# Altium schematic sheet 主控板-国赛.SchDoc: *主控板
size A3; Date: 1; Author: 1*; CompanyName: 1; Organization: 1; DocumentNumber: 1; Revision: 文小林; SheetNumber: 1; SheetTotal: 1; CurrentDate: 1; Time: 1; DocumentFullPathAndName: 1; DocumentName: 1; ProjectName: 1
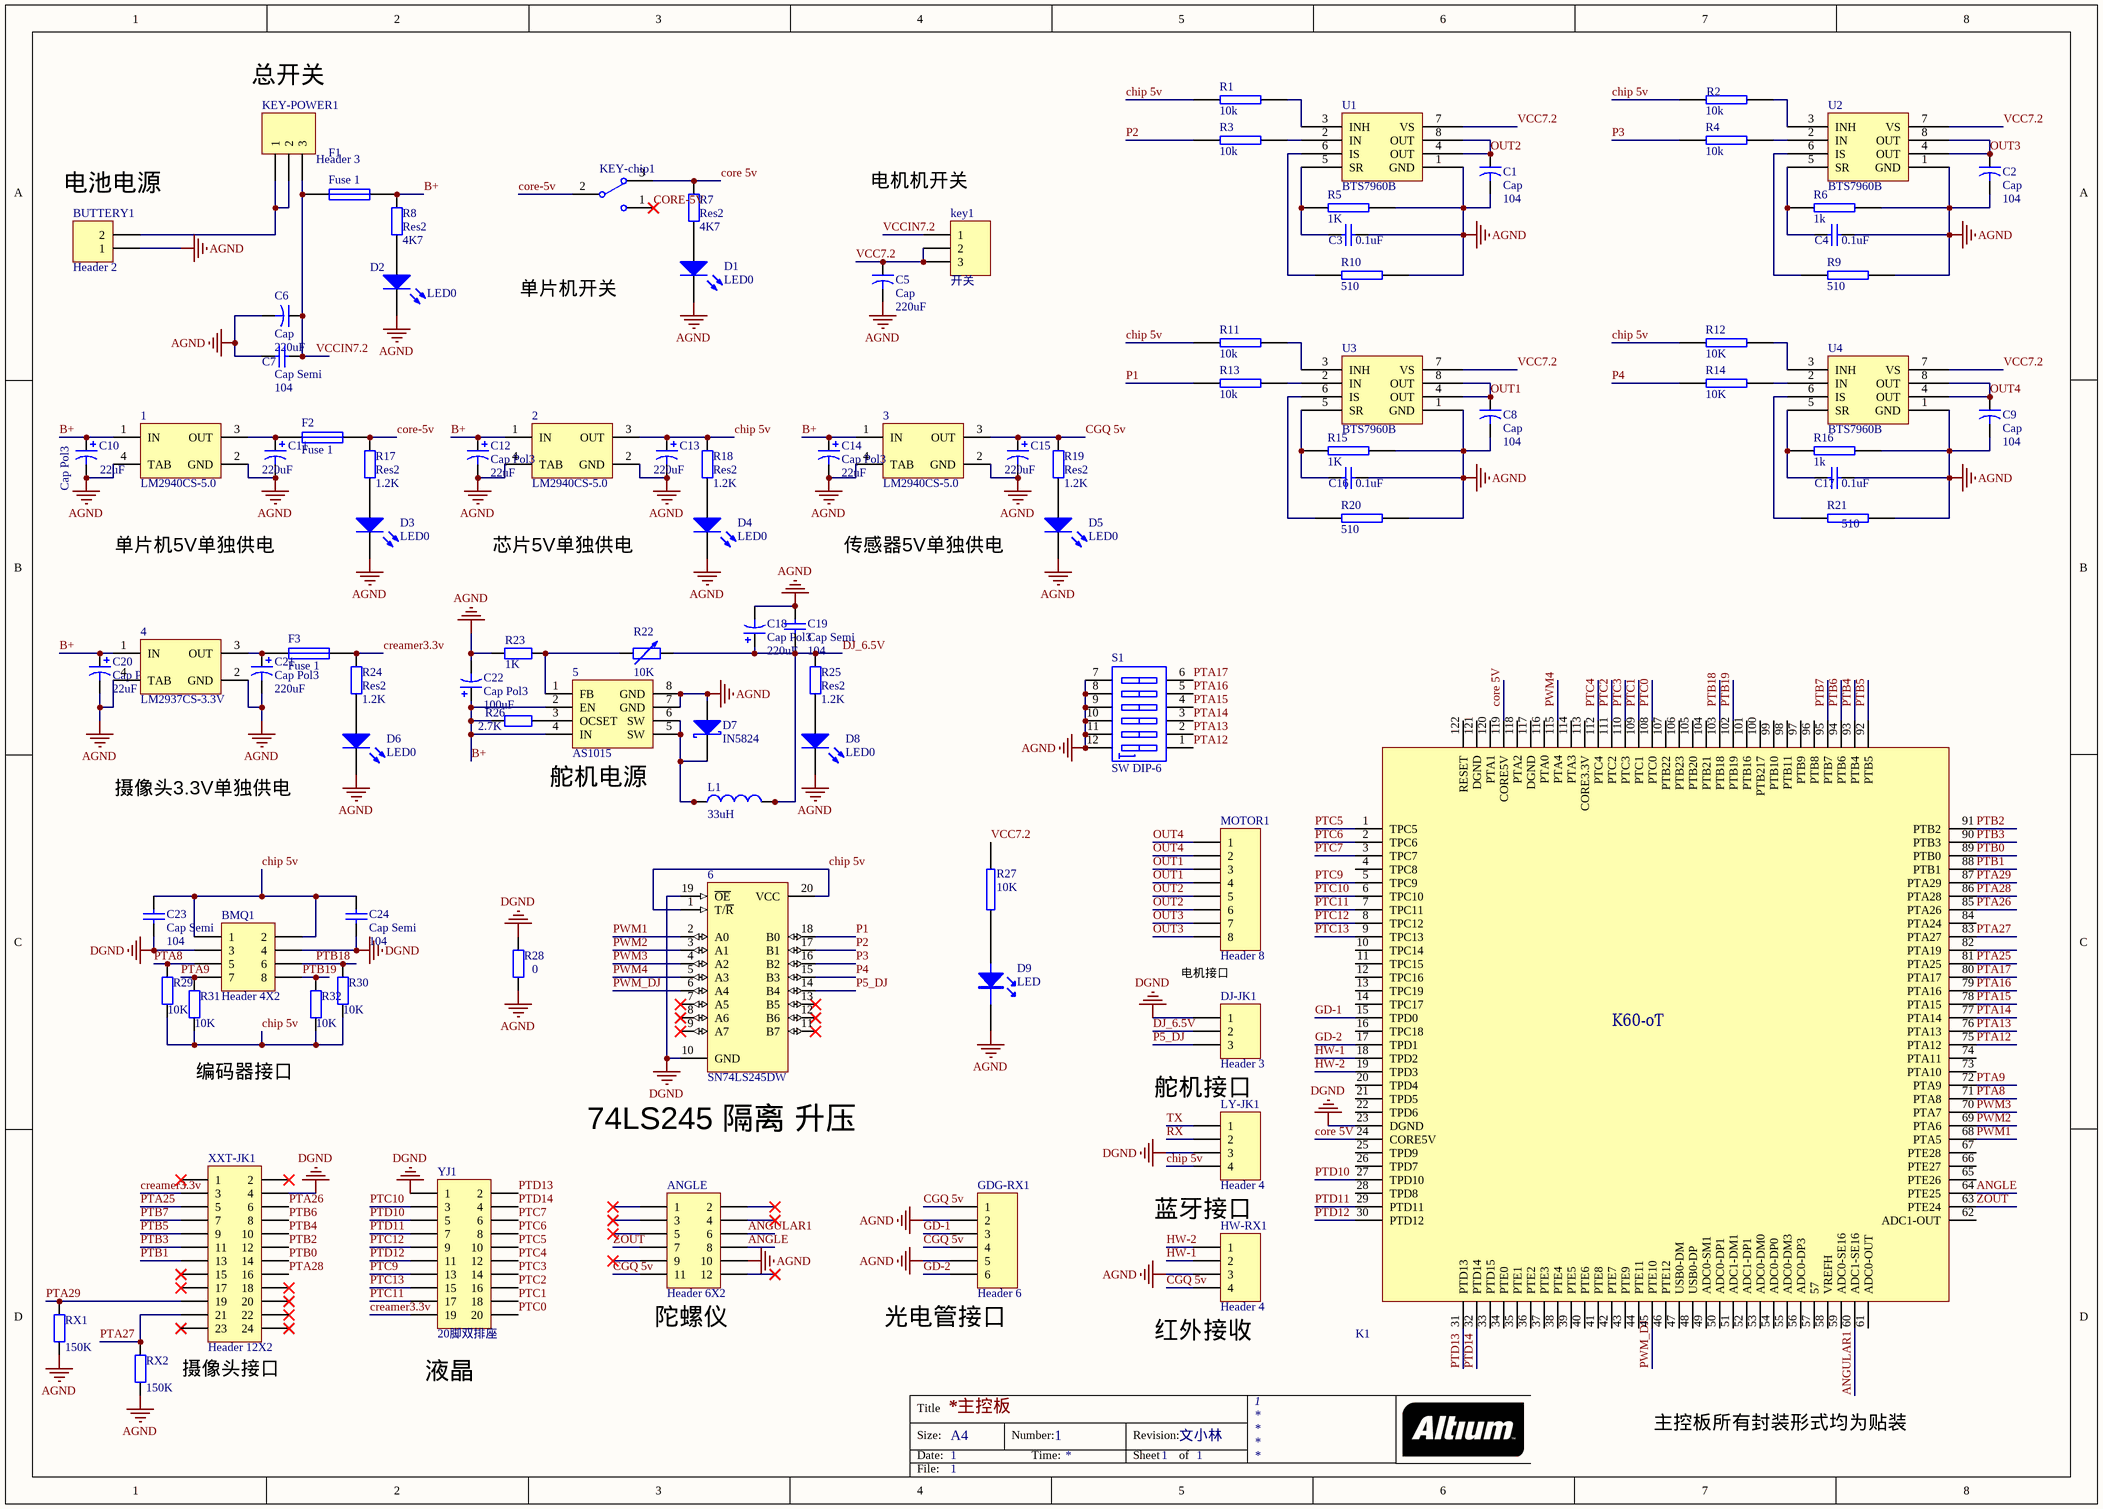
[diagram p0: 主控板-国赛.SchDoc]

## Parts
1  LM2940CS-5.0  [PCBComponent_1]
2  LM2940CS-5.0  [PCBComponent_1]
3  LM2940CS-5.0  [PCBComponent_1]
4  LM2937CS-3.3V  [PCBComponent_1]
5  AS1015  [SOIC-8(TPS7350)]
6  SN74LS245DW  [SN74HCxx-20P]
ANGLE  Header 6X2  [HDR2X6]
BMQ1  Header 4X2  [HDR2X4]
BUTTERY1  Header 2  [电源]
C1  Cap  value 104  [0805]
C2  Cap  value 104  [0805]
C3  value 0.1uF  [0805]
C4  value 0.1uF  [0805]
C5  Cap  value 220uF  [PCBComponent_1]
C6  Cap  value 220uF  [PCBComponent_1]
C7  Cap Semi  value 104  [0805]
C8  Cap  value 104  [0805]
C9  Cap  value 104  [0805]
C10  Cap Pol3  value 22uF  [PCBComponent_1]
C11  value 220uF  [PCBComponent_1]
C12  Cap Pol3  value 22uF  [PCBComponent_1]
C13  value 220uF  [PCBComponent_1]
C14  Cap Pol3  value 22uF  [PCBComponent_1]
C15  value 220uF  [PCBComponent_1]
C16  value 0.1uF  [0805]
C17  value 0.1uF  [0805]
C18  Cap Pol3  value 220uF  [PCBComponent_1]
C19  Cap Semi  value 104  [0805]
C20  Cap Pol3  value 22uF  [PCBComponent_1]
C21  Cap Pol3  value 220uF  [PCBComponent_1]
C22  Cap Pol3  value 100uF  [PCBComponent_1]
C23  Cap Semi  value 104  [0805]
C24  Cap Semi  value 104  [0805]
D1  LED0  [PCBComponent_1]
D2  LED0  [PCBComponent_1]
D3  LED0  [PCBComponent_1]
D4  LED0  [PCBComponent_1]
D5  LED0  [PCBComponent_1]
D6  LED0  [PCBComponent_1]
D7  IN5824  [PCBComponent_1]
D8  LED0  [PCBComponent_1]
D9  LED  [PCBComponent_1]
DJ-JK1  Header 3  [HDR1X3]
F1  Fuse 1  [PCBComponent_1]
F2  Fuse 1  [PCBComponent_1]
F3  Fuse 1  [PCBComponent_1]
GDG-RX1  Header 6  [HDR1X6]
HW-RX1  Header 4  [HDR1X4]
K1  K60-4  [PCBComponent_1]  (value not drawn)
key1  开关  [扭子开关（3脚）]
KEY-chip1  SW-SPDT  [HDR1X3]  (value not drawn)
KEY-POWER1  Header 3  [扭子开关（3脚）]
L1  value 33uH  [PCBComponent_1]  (hidden comment: 33uH(工字电感))
LY-JK1  Header 4  [PCBComponent_1]
MOTOR1  Header 8  [PCBComponent_1]
R1  10k  [0805]
R2  10k  [0805]
R3  10k  [0805]
R4  10k  [0805]
R5  1K  [0805]
R6  1k  [0805]
R7  Res2  value 4K7  [0805]
R8  Res2  value 4K7  [0805]
R9  510  [0805]
R10  510  [0805]
R11  10k  [0805]
R12  10K  [0805]
R13  10k  [0805]
R14  10K  [0805]
R15  1K  [0805]
R16  1k  [0805]
R17  Res2  value 1.2K  [0805]
R18  Res2  value 1.2K  [0805]
R19  Res2  value 1.2K  [0805]
R20  510  [0805]
R21  510  [0805]
R22  value 10K  [卧式可变电阻器]  (hidden comment: Res Adj2)
R23  value 1K  [0805]  (hidden comment: Res2)
R24  Res2  value 1.2K  [0805]
R25  Res2  value 1.2K  [0805]
R26  value 2.7K  [0805]  (hidden comment: Res2)
R27  10K  [0805]
R28  value 0  [0805]
R29  value 10K  [0805]
R30  value 10K  [0805]
R31  value 10K  [0805]
R32  value 10K  [0805]
RX1  value 150K  [0805]
RX2  value 150K  [0805]
S1  SW DIP-6  [DIP-12/SW]
U1  BTS7960B  [PCBComponent_1]
U2  BTS7960B  [PCBComponent_1]
U3  BTS7960B  [PCBComponent_1]
U4  BTS7960B  [PCBComponent_1]
XXT-JK1  Header 12X2  [PCBComponent_1]
YJ1  20脚双排座  [HDR2X10]

## Nets
AGND: 1.2(GND) 1.4(TAB) 2.2(GND) 2.4(TAB) 3.2(GND) 3.4(TAB) 4.2(GND) 4.4(TAB) 5.7(GND) 5.8(GND) ANGLE.10 BUTTERY1.1 C1.2 C2.2 C3.1 C4.1 C5.2 C6.2 C7.1 C8.2 C9.2 C10.2 C11.2 C12.2 C13.2 C14.2 C15.2 C16.1 C17.1 C18.2 C19.2 C20.2 C21.2 C22.2 D1.2(K) D2.2(K) D3.2(K) D4.2(K) D5.2(K) D6.2(K) D7.1(A) D8.2(K) D9.2 GDG-RX1.2 GDG-RX1.5 HW-RX1.3 R5.2 R6.2 R9.2 R10.2 R15.2 R16.2 R20.2 R21.2 R23.1 R28.1 RX1.1 RX2.1 S1.7(B6) S1.8(B5) S1.9(B4) S1.10(B3) S1.11(B2) S1.12(B1) U1.1(GND) U2.1(GND) U3.1(GND) U4.1(GND)
DGND: 6.10(GND) 6.19(~{OE}) BMQ1.3 BMQ1.4 C23.1 C24.1 DJ-JK1.1 K1.23(DGND) LY-JK1.3 R28.2 XXT-JK1.4 YJ1.1
ANGLE: ANGLE.8 K1.64(PTE25)
ANGULAR1: ANGLE.6 K1.60(ADC1-SE16)
B+: 1.1(IN) 2.1(IN) 3.1(IN) 4.1(IN) 5.2(EN) 5.4(IN) C10.1 C12.1 C14.1 C20.1 C22.1 F1.2 R8.2 R26.2
CGQ 5v: 3.3(OUT) ANGLE.11 C15.1 GDG-RX1.1 GDG-RX1.4 HW-RX1.4 R19.2
chip 5v: 2.3(OUT) 6.1(T/~{R}) 6.20(VCC) BMQ1.1 BMQ1.2 C13.1 C23.2 C24.2 LY-JK1.4 R1.1 R2.1 R11.1 R12.1 R18.2 R29.1 R30.1 R31.1 R32.1
core 5v: K1.24(CORE5V) K1.119(CORE5V) KEY-chip1.3 R7.2
core-5v: F2.2 KEY-chip1.1 KEY-chip1.2 R17.2
creamer3.3v: F3.2 R24.2 XXT-JK1.3 YJ1.19
DJ_6.5V: C18.1 C19.1 DJ-JK1.2 L1.2 R22.2 R25.2
GD-1: GDG-RX1.3 K1.15(TPD0)
GD-2: GDG-RX1.6 K1.17(TPD1)
HW-1: HW-RX1.2 K1.18(TPD2)
HW-2: HW-RX1.1 K1.19(TPD3)
OUT1: C8.1 MOTOR1.3 MOTOR1.4 U3.4(OUT) U3.8(OUT)
OUT2: C1.1 MOTOR1.5 MOTOR1.6 U1.4(OUT) U1.8(OUT)
OUT3: C2.1 MOTOR1.7 MOTOR1.8 U2.4(OUT) U2.8(OUT)
OUT4: C9.1 MOTOR1.1 MOTOR1.2 U4.4(OUT) U4.8(OUT)
P1: 6.18(B0) R13.1
P2: 6.17(B1) R3.1
P3: 6.16(B2) R4.1
P4: 6.15(B3) R14.1
P5_DJ: 6.14(B4) DJ-JK1.3
PTA8: BMQ1.5 K1.71(PTA8) R29.2
PTA9: BMQ1.7 K1.72(PTA9) R31.2
PTA12: K1.75(PTA12) S1.1(A1)
PTA13: K1.76(PTA13) S1.2(A2)
PTA14: K1.77(PTA14) S1.3(A3)
PTA15: K1.78(PTA15) S1.4(A4)
PTA16: K1.79(PTA16) S1.5(A5)
PTA17: K1.80(PTA17) S1.6(A6)
PTA25: K1.81(PTA25) XXT-JK1.5
PTA26: K1.85(PTA26) XXT-JK1.6
PTA27: K1.83(PTA27) RX2.2 XXT-JK1.21
PTA28: K1.86(PTA28) XXT-JK1.16
PTA29: K1.87(PTA29) RX1.2 XXT-JK1.19
PTB0: K1.89(PTB0) XXT-JK1.14
PTB1: K1.88(PTB1) XXT-JK1.13
PTB2: K1.91(PTB2) XXT-JK1.12
PTB3: K1.90(PTB3) XXT-JK1.11
PTB4: K1.93(PTB4) XXT-JK1.10
PTB5: K1.92(PTB5) XXT-JK1.9
PTB6: K1.94(PTB6) XXT-JK1.8
PTB7: K1.95(PTB7) XXT-JK1.7
PTB18: BMQ1.6 K1.103(PTB18) R30.2
PTB19: BMQ1.8 K1.102(PTB19) R32.2
PTC0: K1.108(PTC0) YJ1.20
PTC1: K1.109(PTC1) YJ1.18
PTC2: K1.111(PTC2) YJ1.16
PTC3: K1.110(PTC3) YJ1.14
PTC4: K1.112(PTC4) YJ1.12
PTC5: K1.1(TPC5) YJ1.10
PTC6: K1.2(TPC6) YJ1.8
PTC7: K1.3(TPC7) YJ1.6
PTC9: K1.5(TPC9) YJ1.13
PTC10: K1.6(TPC10) YJ1.3
PTC11: K1.7(TPC11) YJ1.17
PTC12: K1.8(TPC12) YJ1.9
PTC13: K1.9(TPC13) YJ1.15
PTD10: K1.27(TPD10) YJ1.5
PTD11: K1.29(PTD11) YJ1.7
PTD12: K1.30(PTD12) YJ1.11
PTD13: K1.31(PTD13) YJ1.2
PTD14: K1.32(PTD14) YJ1.4
PWM1: 6.2(A0) K1.68(PTA5)
PWM2: 6.3(A1) K1.69(PTA6)
PWM3: 6.4(A2) K1.70(PTA7)
PWM4: 6.5(A3) K1.115(PTA4)
PWM_DJ: 6.6(A4) K1.45(PTE10)
RX: LY-JK1.2
TX: LY-JK1.1
VCC7.2: C5.1 key1.2 key1.3 R27.1 U1.7(VS) U2.7(VS) U3.7(VS) U4.7(VS)
VCCIN7.2: C6.1 C7.2 F1.1 key1.1 KEY-POWER1.3
ZOUT: ANGLE.7 K1.63(PTE24)
Net1_3: 1.3(OUT) C11.1 F2.1
Net4_3: 4.3(OUT) C21.1 F3.1
Net5_1: 5.1(FB) R22.1 R23.2
Net5_3: 5.3(OCSET) R26.1
Net5_5: 5.5(SW) 5.6(SW) D7.2(K) L1.1
NetBUTTERY1_2: BUTTERY1.2 KEY-POWER1.1 KEY-POWER1.2
NetC3_2: C3.2 R5.1 U1.5(SR)
NetC4_2: C4.2 R6.1 U2.5(SR)
NetC16_2: C16.2 R15.1 U3.5(SR)
NetC17_2: C17.2 R16.1 U4.5(SR)
NetD1_1: D1.1(A) R7.1
NetD2_1: D2.1(A) R8.1
NetD3_1: D3.1(A) R17.1
NetD4_1: D4.1(A) R18.1
NetD5_1: D5.1(A) R19.1
NetD6_1: D6.1(A) R24.1
NetD8_1: D8.1(A) R25.1
NetD9_1: D9.1 R27.2
NetR1_2: R1.2 U1.3(INH)
NetR2_2: R2.2 U2.3(INH)
NetR3_2: R3.2 U1.2(IN)
NetR4_2: R4.2 U2.2(IN)
NetR9_1: R9.1 U2.6(IS)
NetR10_1: R10.1 U1.6(IS)
NetR11_2: R11.2 U3.3(INH)
NetR12_2: R12.2 U4.3(INH)
NetR13_2: R13.2 U3.2(IN)
NetR14_2: R14.2 U4.2(IN)
NetR20_1: R20.1 U3.6(IS)
NetR21_1: R21.1 U4.6(IS)

Not connected (* = marked no-connect by the designer): 6 7(A5)* 8(A6)* 9(A7)* 11(B7)* 12(B6)* 13(B5)*; ANGLE 1* 2* 3* 4* 5* 9* 12*; K1 4(TPC8) 10(TPC14) 11(TPC15) 12(TPC16) 13(TPC19) 14(TPC17) 16(TPC18) 20(TPD4) 21(TPD5) 22(TPD6) 25(TPD9) 26(TPD7) 28(TPD8) 33(PTD15) 34(PTE0) 35(PTE1) 36(PTE2) 37(PTE3) 38(PTE4) 39(PTE5) 40(PTE6) 41(PTE8) 42(PTE7) 43(PTE9) 44(PTE11) 46(PTE12) 47(USB0-DM) 48(USB0-DP) 49(ADC0-SM1) 50(ADC0-DP1) 51(ADC1-DM1) 52(ADC1-DP1) 53(ADC0-DM0) 54(ADC0-DP0) 55(ADC0-DM3) 56(ADC0-DP3) 57 58(VREFH) 59(ADC0-SE16) 61(ADC0-OUT) 62(ADC1-OUT) 65(PTE26) 66(PTE27) 67(PTE28) 73(PTA10) 74(PTA11) 82(PTA19) 84(PTA24) 96(PTB8) 97(PTB9) 98(PTB11) 99(PTB10) 100(PTB217) 101(PTB16) 104(PTB21) 105(PTB20) 106(PTB23) 107(PTB22) 113(CORE3.3V) 114(PTA3) 116(PTA0) 117(DGND) 118(PTA2) 120(PTA1) 121(DGND) 122(RESET); XXT-JK1 1* 2* 15* 17* 18* 20* 22* 23* 24*

## Notes on the sheet
- 总开关
- (near BUTTERY1) 电池电源
- (near key1) 电机机开关
- 单片机开关
- 单片机5V单独供电
- (near D4) 芯片5V单独供电
- (near D5) 传感器5V单独供电
- 舵机电源
- (near D6) 摄像头3.3V单独供电
- 电机接口
- 编码器接口
- 舵机接口
- (near 6) 74LS245 隔离 升压
- 蓝牙接口
- (near ANGLE) 陀螺仪
- (near GDG-RX1) 光电管接口
- 摄像头接口
- (near YJ1) 液晶
- (near HW-RX1) 红外接收
- 主控板所有封装形式均为贴装
- Title
- Size:
- Date:
- A4
- Number:
- Time:
- Revision:
- Sheet
- of
- File:
- (in symbol K60-4) K60-оƬ

## Library data of the parts
1-4 = LM2940CS-5.0: 1A Low Dropout Regulator; Manufacturer: National Semiconductor; CompType: LDO IC; PackageTopMarking: NSUZXYTTE#*LM2940CS*-5.0 P+; PowerWise: N; Published: 4-Dec-2008; DatasheetVersion: Jan-2007; PackageVersion: revF, Apr-2005; PackageReference: TS3B; Publisher: Altium Limited; PackageDescription: TO-263, Molded, .400 x .390 x .180in, 3 Lead, .1in Pitch, Surface Mount; PartNumber: LM2940CS-5.0; RoHS: O; PinCount: 3; DigiKeyPartNumber: LM2940CS-5.0-ND; Code_JEDEC: MO-169-AA; ComponentLink1Description: LM2940C Datasheet; ComponentLink1URL: http://www.national.com/ds/LM/LM2940C.pdf; ComponentLink2Description: LM2940C Web Page; ComponentLink2URL: http://www.national.com/pf/LM/LM2940C.html; ComponentLink3Description: TS3B Package Page; ComponentLink3URL: http://www.national.com/packaging/folders/ts3b.html
6 = SN74LS245DW: Octal Bus Transceiver with 3-State Outputs; Published: 8-Jun-2000; LatestRevisionDate: 13-Apr-2006; LatestRevisionNote: IPC-7351 Footprint Added.; DatasheetVersion: Mar-1988; PackageVersion: Mar-2000; PackageReference: DW020; Publisher: Altium Limited; PackageDescription: 20-Pin Plastic Small Outline Integrated Circuit 1.27 mm Pitch; Code_JEDEC: MS-013; Code_IPC: SOIC127P1030-20; ComponentLink1Description: Manufacturer Link; ComponentLink1URL: http://www.ti.com/; ComponentLink2Description: Datasheet; ComponentLink2URL: http://www-s.ti.com/sc/ds/sn74ls245.pdf
ANGLE = Header 6X2: Header, 6-Pin, Dual row; LatestRevisionDate: 17-Jul-2002; LatestRevisionNote: Re-released for DXP Platform.; Publisher: Altium Limited
BMQ1 = Header 4X2: Header, 4-Pin, Dual row; LatestRevisionDate: 17-Jul-2002; LatestRevisionNote: Re-released for DXP Platform.; Publisher: Altium Limited
BUTTERY1 = Header 2: Header, 2-Pin; LatestRevisionDate: 17-Jul-2002; LatestRevisionNote: Re-released for DXP Platform.; Publisher: Altium Limited
C1 C2 C5 C6 C8 C9 = Cap2: Capacitor; Published: 23-Sep-2002; PackageReference: CAPR5-4X5; Publisher: Altium Limited; PackageDescription: Capacitor; 2 Leads
C3 C4 C16 C17 = Cap: Capacitor; Published: 8-Jun-2000; LatestRevisionDate: 17-Jul-2002; LatestRevisionNote: Re-released for DXP Platform.; PackageReference: RAD-0.3; Publisher: Altium Limited
C7 C19 C23 C24 = Cap Semi: Capacitor (Semiconductor SIM Model); Published: 8-Jun-2000; LatestRevisionDate: 29-May-2009; LatestRevisionNote: IPC-7351 Footprint Added.; PackageReference: C1206; Publisher: Altium Limited; PackageDescription: Chip Capacitor
C10 C12 C14 C18 C20-C22 = Cap Pol3: Polarized Capacitor (Surface Mount); Published: 8-Jun-2000; LatestRevisionDate: 29-May-2009; LatestRevisionNote: IPC-7351 Footprint Added.; PackageReference: C0805; Publisher: Altium Limited; PackageDescription: Chip Capacitor
C11 C13 C15 = Cap Pol1: Polarized Capacitor (Radial); Published: 8-Jun-2000; LatestRevisionDate: 17-Jul-2002; LatestRevisionNote: Re-released for DXP Platform.; PackageReference: RB7.6-15; Publisher: Altium Limited
D1-D6 D8 = LED0: Typical INFRARED GaAs LED; Published: 8-Jun-2000; LatestRevisionDate: 08-Jul-2005; LatestRevisionNote: Mech Layer 1 removed.; PackageReference: LED-0; Publisher: Altium Limited; PackageDescription: LED; 2 Leads
D7 = D Schottky: Schottky Diode; Published: 8-Jun-2000; LatestRevisionDate: 17-Jul-2002; LatestRevisionNote: Re-released for DXP Platform.; PackageReference: SMB; Publisher: Altium Limited; PackageDescription: DO-214-AA/SMB; 2 C-Bend Leads; Body 5.3 x 3.6 mm, inc. leads (LxW); Code_JEDEC: DO-214-AA
DJ-JK1 key1 KEY-POWER1 = Header 3: Header, 3-Pin; LatestRevisionDate: 17-Jul-2002; LatestRevisionNote: Re-released for DXP Platform.; Publisher: Altium Limited
F1-F3 = Fuse 1: Fuse; Published: 8-Jun-2000; LatestRevisionDate: 17-Jul-2002; LatestRevisionNote: Re-released for DXP Platform.; PackageReference: PIN-W2/E2.8; Publisher: Altium Limited; PackageDescription: Thru-Hole; 2 Leads
GDG-RX1 = Header 6: Header, 6-Pin; LatestRevisionDate: 17-Jul-2002; LatestRevisionNote: Re-released for DXP Platform.; Publisher: Altium Limited
HW-RX1 LY-JK1 = Header 4: Header, 4-Pin; LatestRevisionDate: 17-Jul-2002; LatestRevisionNote: Re-released for DXP Platform.; Publisher: Altium Limited
KEY-chip1 = SW-SPDT: SPDT Subminiature Toggle Switch, Right Angle Mounting, Vertical Actuation; Published: 24-Mar-1999; LatestRevisionDate: 17-Dec-2003; LatestRevisionNote: Schematic revised, PCB Footprint replaced.; DatasheetVersion: 05-Dec-2000; PackageReference: TL36WW15050; Publisher: Altium Limited; PackageDescription: Switch; 4 Leads; ComponentLink1Description: Manufacturer Link; ComponentLink1URL: http://www.apem.com
L1 = Inductor: Code_IEC: 1005; Published: 8-Jun-2000; LatestRevisionDate: 29-May-2009; LatestRevisionNote: IPC-7351 Footprint Added.; PackageReference: 0402-A; Publisher: Altium Limited; PackageDescription: Chip Inductor; Code_JEITA: 0402
MOTOR1 = Header 8: Header, 8-Pin; LatestRevisionDate: 17-Jul-2002; LatestRevisionNote: Re-released for DXP Platform.; Publisher: Altium Limited
R1-R6 R9-R16 R20 R21 R27 = RES2
R7 R8 R17-R19 R23-R26 R28-R32 RX1 RX2 = Res2: Resistor; Published: 8-Jun-2000; LatestRevisionDate: 17-Jul-2002; LatestRevisionNote: Re-released for DXP Platform.; PackageReference: AXIAL-0.4; Publisher: Altium Limited
  R23 R26 RX1 RX2: PackageDescription: Axial Device, Thru-Hole; 2 Leads; 0.4 in Pin Spacing
R22 = Res Adj2: Variable Resistor; Set Position: 0.5; Published: 8-Jun-2000; LatestRevisionDate: 17-Jul-2002; LatestRevisionNote: Re-released for DXP Platform.; PackageReference: AXIAL-0.6; Publisher: Altium Limited; PackageDescription: Axial Device, Thru-Hole; 2 Leads; 0.6 in Pin Spacing
S1 = SW DIP-6: DIP Switch, 6 Position, SPST; Published: 24-Mar-1999; LatestRevisionDate: 17-Jul-2002; LatestRevisionNote: Re-released for DXP Platform.; PackageReference: DIP-12/SW; Publisher: Altium Limited
XXT-JK1 = Header 12X2: Header, 12-Pin, Dual row; LatestRevisionDate: 17-Jul-2002; LatestRevisionNote: Re-released for DXP Platform.; Publisher: Altium Limited
YJ1 = Header 10X2: Header, 10-Pin, Dual row; LatestRevisionDate: 17-Jul-2002; LatestRevisionNote: Re-released for DXP Platform.; Publisher: Altium Limited